# EAGLE design Pixeled Proto-A0 (EAGLE 9.5.1)
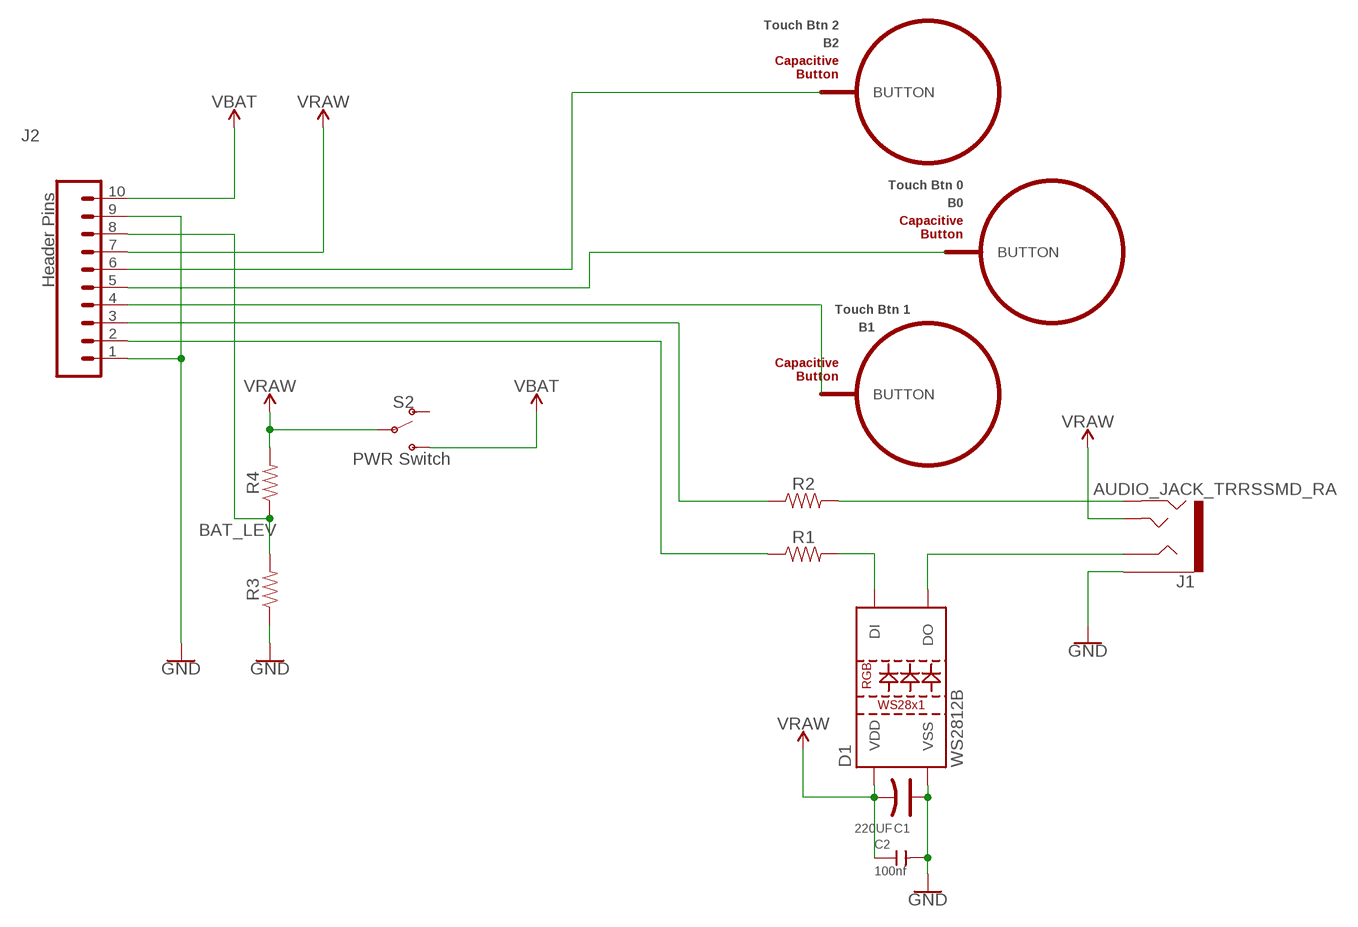
[diagram p0: schematic, sheet 1]

## Parts
B0  Touch Btn 0  BUTTON_PASSIVE8MM  [BUTTON_PASSIVE_8MM]
B1  Touch Btn 1  BUTTON_PASSIVE12MM  [BUTTON_PASSIVE_12MM]
B2  Touch Btn 2  BUTTON_PASSIVE12MM  [BUTTON_PASSIVE_12MM]
C1  220UF  ALUMINUM-SMD-220UF-16V(D6.3-H7.7MM)  [ELECTRO-SMD-C-6MM]
C2  100nf  CERAMIC-100NF-50V-10%-X7R(0805)  [C0805]
D1  WS2812B  [WS2812B]
J1  AUDIO_JACK_TRRSSMD_RA  [AUDIO_JACK_3.5MM_TRRS_SMD_RA]
J2  Header Pins  CONN_10"  [1X10]
R1  RESISTOR0805  [0805]
R2  RESISTOR0805  [0805]
R3  RESISTOR0805  [0805]
R4  RESISTOR0805  [0805]
S2  PWR Switch  SWITCH-SPDT-SMD-RIGHT-ANGLE  [SWITCH_SPST_SMD_A]

## Nets
BAT_LEV: J2.8 R3.2 R4.1
GND: C1.+ C2.2 D1.3(VSS) J1.EARTH J2.1 J2.9 R3.1
N$1: D1.4(DI) R1.2
N$2: D1.2(DO) J1.RING1
N$3: J2.3 R2.1
N$4: J2.2 R1.1
N$5: J1.RING2 R2.2
T0: B2.BUTTON J2.6
T1: B0.BUTTON J2.5
T2: B1.BUTTON J2.4
V_BATT: J2.10 S2.3(S) ; supply symbol labelled VBAT
VRAW: C1.- C2.1 D1.1(VDD) J1.TIP J2.7 R4.2 S2.2(P)
Unconnected: S2.1(O)

## Library data of the parts
B0 B1 B2 = PatternAgents-TouchWidgets:BUTTON_PASSIVE: Button, Passive Capacitive/Touch Sensing Type Source : http://www.PatternAgents.com Github : https://github.com/PatternAgents License : http://creativecommons.org/licenses/by-sa/3.1/ (Creative Commons 3.1) THIS SOFTWARE IS PROVIDED BY THE CONTRIBUTORS "AS IS" AND WITHOUT ANY EXPRESS OR IMPLIED WARRANTIES, INCLUDING, BUT NOT LIMITED TO, THE IMPLIED WARRANTIES OF MERCHANTABILITY AND FITNESS FOR A PARTICULAR PURPOSE ARE DISCLAIMED. IN NO EVENT SHALL THE COPYRIGHT OWNER OR CONTRIBUTORS BE LIABLE FOR ANY DIRECT, INDIRECT, INCIDENTAL, SPECIAL, EXEMPLARY, OR CONSEQUENTIAL DAMAGES (INCLUDING, BUT NOT LIMITED TO, PROCUREMENT OF SUBSTITUTE GOODS OR SERVICES; LOSS OF USE, DATA, OR PROFITS; OR BUSINESS INTERRUPTION) HOWEVER CAUSED AND ON ANY THEORY OF LIABILITY, WHETHER IN CONTRACT, STRICT LIABILITY, OR TORT (INCLUDING NEGLIGENCE OR OTHERWISE) ARISING IN ANY WAY OUT OF THE USE OF THIS SOFTWARE, EVEN IF ADVISED OF THE POSSIBILITY OF SUCH DAMAGE.
C1 = Seeed-Capacitor:ALUMINUM-SMD-220UF-16V(D6.3-H7.7MM): 302030053; MPN: CS1E221M-CRE77
C2 = Seeed-Capacitor:CERAMIC-100NF-50V-10%-X7R(0805): 302010165; MPN: CC0805KRX7R9BB104
D1 = SparkFun-LED:WS2812B: WS2812B SMD addressable RGB LED 5x5mm SMD LED with built-in controller IC. Color: Red/Green/Blue mC Rating: RGB: 390, 660, 180 mcd Forward Voltage: RGB: 2.0, 3.0, 3.0 V Packages:WS2812B SparkFun Products: Blynk Board - ESP8266 <https://www.sparkfun.com/products/13794>; PROD_ID: DIO-12503
J1 = SparkFun-Connectors:AUDIO_JACK_TRRS: Audio Jack - 3.5mm TRRS (SMD) This is a 3.5mm TRRS SMD audio jack. TRRS connectors are the audio-style connectors that you see on some phones, MP3 players and development boards. TRRS stands for “tip, ring, ring, sleeve,” which reflects that this has three conductors and a ground. SparkFun Products: Audio Jack <https://www.sparkfun.com/products/12639> mbed Starter Kit <https://www.sparkfun.com/products/12968> SparkFun TRRS 3.5mm Jack Breakout <https://www.sparkfun.com/products/11570>; PROD_ID: CONN-10676; SF_ID: PRT-12639
J2 = SparkFun-Connectors:CONN_10: Multi connection point. Often used as Generic Header-pin footprint for 0.1 inch spaced/style header connections On any of the 0.1 inch spaced packages, you can populate with these: Break Away Headers - Straight <https://www.sparkfun.com/products/116> (PRT-00116) Break Away Male Headers - Right Angle <https://www.sparkfun.com/products/553> (PRT-00553) Female Headers <https://www.sparkfun.com/products/115> (PRT-00115) Break Away Headers - Machine Pin <https://www.sparkfun.com/products/117> (PRT-00117) Break Away Female Headers - Swiss Machine Pin <https://www.sparkfun.com/products/743> (PRT-00743) Arduino Stackable Header - 10 Pin <https://www.sparkfun.com/products/11376> (PRT-11376) For SCREWTERMINALS and SPRING TERMINALS visit here: Screw Terimnals on SparkFun.com <https://www.sparkfun.com/search/results?term=Screw+Terminals> (5mm/3.5mm/2.54mm spacing) This device is also useful as a general connection point to wire up your design to another part of your project. Our various solder wires solder well into these plated through hole pads. Hook-Up Wire - Assortment (Stranded, 22 AWG) <https://www.sparkfun.com/products/11375> (PRT-11375) Hook-Up Wire - Assortment (Solid Core, 22 AWG) <https://www.sparkfun.com/products/11367> (PRT-11367) View the entire wire category on our website here <https://www.sparkfun.com/categories/141> Special notes: Molex polarized connector foot print use with SKU : PRT-08231 with associated crimp pins and housings. 1MM SMD Version SKU: PRT-10208 NOTES ON THE VARIANTS LOCK and LOCK_LONGPADS... This footprint was designed to help hold the alignment of a through-hole component (i.e. 6-pin header) while soldering it into place. You may notice that each hole has been shifted either up or down by 0.005 of an inch from it's more standard position (which is a perfectly straight line). This slight alteration caused the pins (the squares in the middle) to touch the edges of the holes. Because they are alternating, it causes a "brace" to hold the component in place. 0.005 has proven to be the perfect amount of "off-center" position when using our standard breakaway headers. Although looks a little odd when you look at the bare footprint, once you have a header in there, the alteration is very hard to notice. Also,if you push a header all the way into place, it is covered up entirely on the bottom side.; PROD_ID: CONN-11563
R1-R4 = SparkFun-Resistors:RESISTOR: Generic Resistor Package
S2 = SparkFun-Switches:SWITCH-SPDT: Single Pole, Double Throw (SPDT) Switch Single-pole, double-throw (SPDT) switch. Variant Overview SMD-AYZ0202 Surface Mount DPDT Switch <https://www.sparkfun.com/products/597> (COM-00597) Used on e.g. LilyPad Arduino USB - ATmega32U4 Board <https://www.sparkfun.com/products/12049> PTH-11.6X4.0MM SPDT Mini Power Switch <https://www.sparkfun.com/products/102> (COM-00102) Used on e.g. SparkFun Simon Says - Through-Hole Soldering Kit <https://www.sparkfun.com/products/10547> (KIT-10547) PTH-11.6X4.0MM-KIT KIT version of SPDT Mini Power Switch - Simplifies soldering by removing tStop of switch pins - only one side can be soldered. PTH-11.6X4.0MM-LOCK LOCK version of SPDT Mini Power Switch - Offset pins hold switch in place for easier soldering. SMD-RIGHT-ANGLE Surface Mount Right Angle Switch <https://www.sparkfun.com/products/10860> (COM-10860) Used on e.g. SparkFun ESP8266 Thing <https://www.sparkfun.com/products/13231>; PROD_ID: SWCH-10651; SF_SKU: COM-10860

## Board
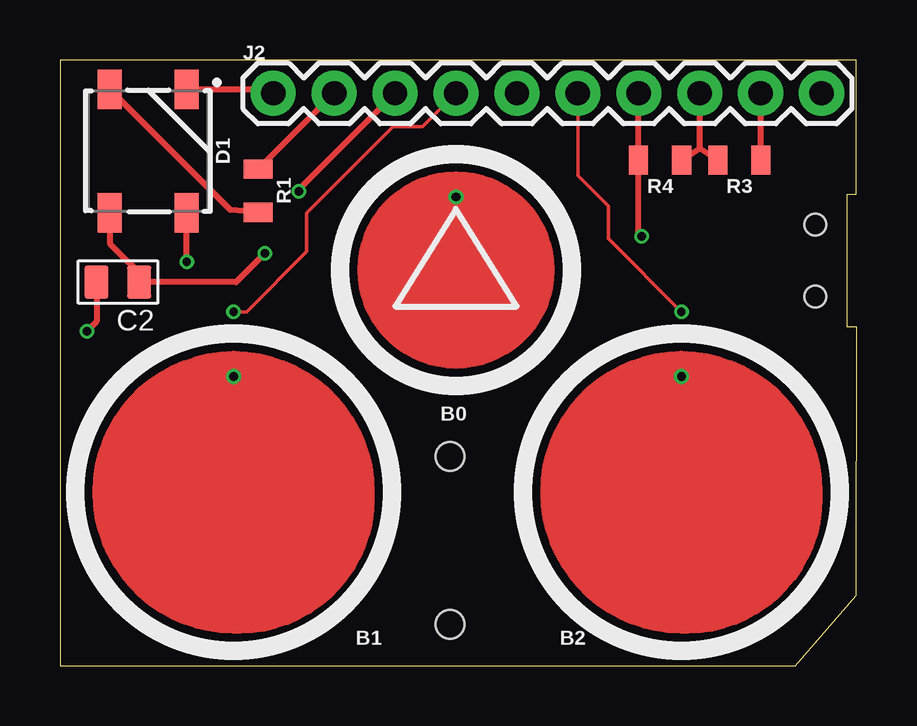
[diagram p1: board, top side]
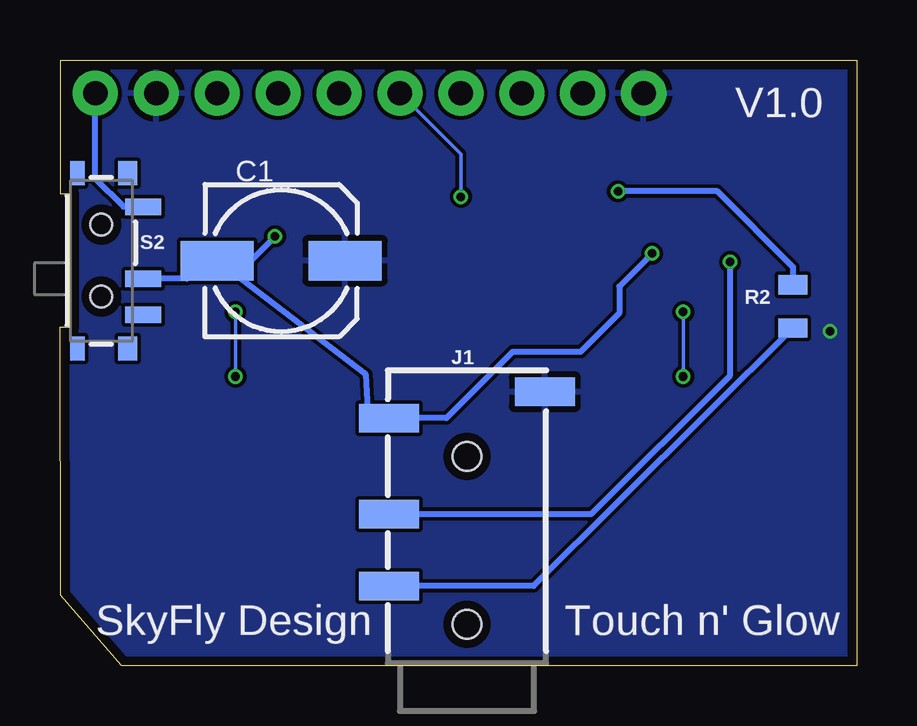
[diagram p2: board, bottom side, seen from below]

Size 33.22 x 25.26 mm. Coordinates in mm from the lower left corner, seen from the top.
Outline: 0,0 30.66,0 33.2,2.95 33.22,14.12 32.82,14.12 32.82,19.66 33.2,19.66 33.2,25.26 0,25.26 0,0
Copper layers (1*16): Top 0.035559375mm / dielectric 1.6mm / Bottom 0.035559375mm
Design rules "oshpark-2layer": minimum track width 6mil, minimum drill 10mil, track to track 6mil, track to pad 6mil, pad to pad 6mil, via to via 6mil, smd to smd 6mil, copper to edge 15mil, drill to drill 6mil, minimum pad ring 5mil, minimum via ring 5mil, stop-mask expansion 2.5mil, vias tented up to drill 0mil, thermal gap 10mil

### Footprints (pad centres in the part's own frame; a part is rotated, then mirrored left to right if it is on the bottom)
BUTTON_PASSIVE_8MM = drill 0.356: BUTTON 0,3.048
BUTTON_PASSIVE_12MM = drill 0.356: BUTTON 0,4.826
ELECTRO-SMD-C-6MM = smd 3.048 x 1.651: + 2.667,0; - -2.667,0
C0805 = smd 1.397 x 1.016: 1 0,0.889; 2 0,-0.889
WS2812B = smd 1.651 x 1: 1 2.577,-1.6; 2 2.577,1.6; 3 -2.577,1.6; 4 -2.577,-1.6
AUDIO_JACK_3.5MM_TRRS_SMD_RA = smd 1.2 x 2.5: EARTH 11.3,-3.25; RING1 6.2,3.25; RING2 3.2,3.25; TIP 10.2,3.25 | hole 1.2: 1.6,0; 8.6,0
1X10 = drill 1.016 pad 1.88: 1 0,0; 2 2.54,0; 3 5.08,0; 4 7.62,0; 5 10.16,0; 6 12.7,0; 7 15.24,0; 8 17.78,0; 9 20.32,0; 10 22.86,0
0805 = smd 0.8 x 1.2: 1 -0.9,0; 2 0.9,0
SWITCH_SPST_SMD_A = smd 0.7 x 1.5: 1 -2.25,-1.75; 2 -0.75,-1.75; 3 2.25,-1.75 | smd 1 x 0.6: GND1 -3.65,1; GND3 3.65,1 | smd 1 x 0.8: GND2 -3.65,-1.1; GND4 3.65,-1.1 | hole 0.9: -1.5,0; 1.5,0

### Placement (x,y rotation side)
B0  16.51,16.51 0 top
B1  7.24,7.24 0 top
B2  25.91,7.24 0 top
C1  24,16.89 0 bottom
C2  2.41,16 270 top
D1  3.68,21.46 270 top
J1  16.26,0.13 90 bottom
J2  8.89,23.88 0 top
R1  8.26,19.81 270 top
R2  2.67,14.99 270 bottom
R3  28.32,21.08 180 top
R4  25.02,21.08 180 top
S2  31.5,16.89 90 bottom

### Tracks (layer width: path | path; a pad name or v marks a point on that pad's centre or on a via)
BAT_LEV
  Top 0.254: R4.1 26.67,21.59 | 26.67,21.59 R3.2 | 26.67,21.59 J2.8
GND  (via drill 0.35)
  Top 0.254: R3.1 29.22,23.86 J2.9 | D1.3 8.73,24.04 J2.1 | C2.2 1.52,14.35 v1.12,13.95
  pour Bottom: 0,0 0,25.4 33.02,25.4 33.02,0
N$1
  Top 0.254: D1.4 7.11,19.01 R1.2
N$2  (via drill 0.35)
  Top 0.254: v5.28,16.84 | v5.28,16.84 D1.2
  Bottom 0.254: J1.RING1 11.07,6.33 5.28,12.12 v5.28,16.84
N$3  (via drill 0.35)
  Top 0.254: J2.3 9.96,19.86 v9.96,19.79
  Bottom 0.254: v9.96,19.79 5.82,19.79 2.67,16.64 R2.1
N$4
  Top 0.254: J2.2 8.53,20.98 R1.1
N$5
  Bottom 0.254: R2.2 13.48,3.33 J1.RING2
T0  (via drill 0.35)
  Top 0.152: J2.6 21.59,20.45 22.86,19.18 22.86,17.8 v25.91,14.76
  Bottom 0.152: v25.91,14.76 B2.BUTTON
T1
  Bottom 0.152: B0.BUTTON 16.51,21.34 J2.5
T2  (via drill 0.35)
  Top 0.152: J2.4 15.11,22.48 13.88,22.48 10.29,18.88 10.29,17.27 7.77,14.76 v7.24,14.76
  Bottom 0.152: v7.24,14.76 B1.BUTTON
V_BATT
  Bottom 0.254: S2.3 30.57,19.14 31.75,20.32 J2.10
VRAW  (via drill 0.35)
  Top 0.254: v8.53,17.2 7.34,16 3.7,16 | 3.7,16 2.08,17.62 D1.1 | J2.7 24.12,23.86 R4.2 24.12,18.05 v24.26,17.91 | C2.1 3.7,16
  Bottom 0.254: 27.24,16.32 C1.- 20.47,12.14 20.36,10.33 J1.TIP 17.12,10.33 14.34,13.11 11.51,13.11 9.91,14.71 9.91,15.82 v8.53,17.2 | S2.2 27.93,16.14 27.75,16.32 27.24,16.32 | v24.26,17.91 25.84,16.32 27.24,16.32

### Text on the board
bPlace: V1.0 | Touch n' Glow | SkyFly Design